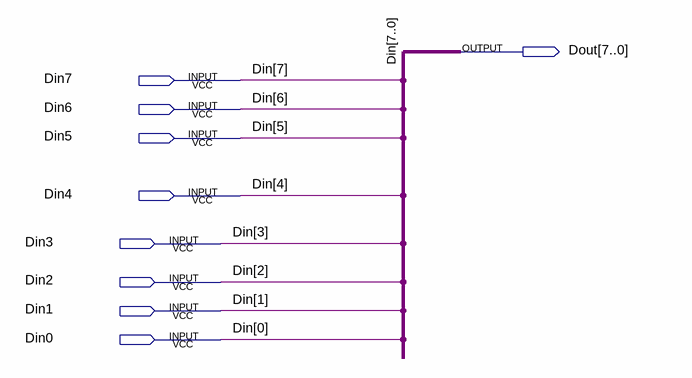
[diagram p0: schematic sheet]
// Quartus schematic bitToBus_8bit.bdf as structural Verilog: 0 symbols, 9 pins
module bitToBus_8bit (
  input  Din7,
  input  Din6,
  input  Din5,
  input  Din4,
  input  Din3,
  input  Din2,
  input  Din1,
  input  Din0,
  output [7:0] Dout
);


  assign Dout = {Din7, Din6, Din5, Din4, Din3, Din2, Din1, Din0};
endmodule
